# Altium schematic sheet 5_Regulator.SchDoc
size A4; SheetNumber: 6; SheetTotal: 6
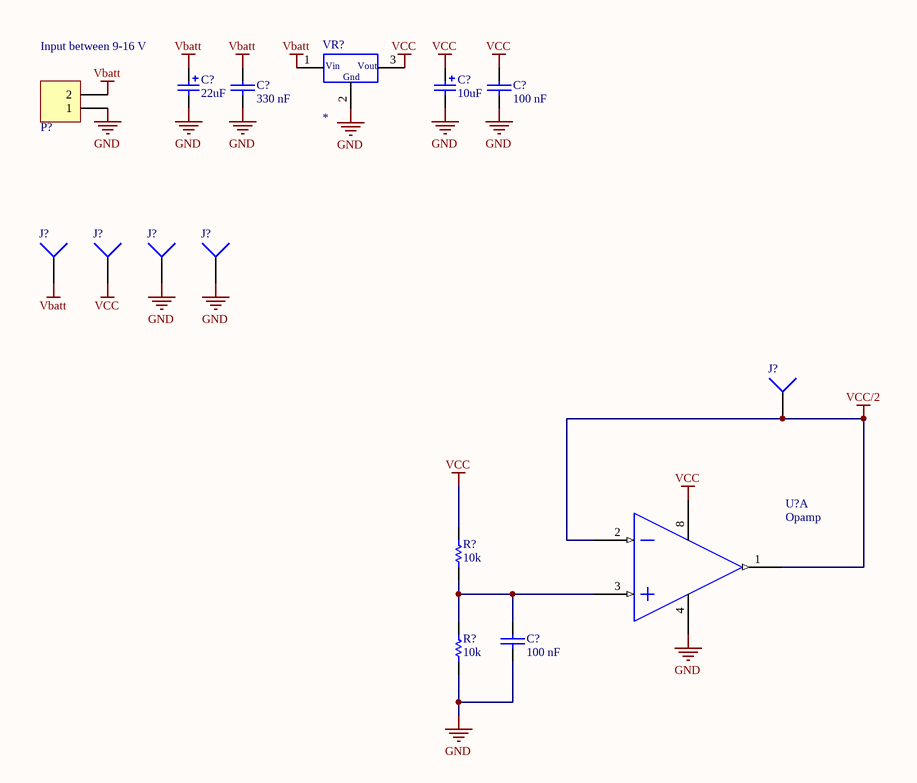
[diagram p0: 5_Regulator.SchDoc]

## Parts
(Parts that share a designator on the sheet are numbered #1, #2 ... from top to bottom, then left to right.)
C?#1  22uF  [ece-CAPAD2TH0.3]
C?#2  330 nF  [ece-RAD0.2]
C?#3  10uF  [ece-CAPAD2TH0.3]
C?#4  100 nF  [ece-RAD0.2]
C?#5  100 nF  [ece-RAD0.2]
J?#1  Vbatt  [ece-HDR1]  (value not drawn)
J?#2  Vcc  [ece-HDR1]  (value not drawn)
J?#3  GND  [ece-HDR1]  (value not drawn)
J?#4  GND  [ece-HDR1]  (value not drawn)
J?#5  Vcc/2  [ece-HDR1]  (value not drawn)
P?  Header 2  [ece-TER2-10MM]  (value not drawn)
R?#1  10k  [ece-AXIAL0.4]
R?#2  10k  [ece-AXIAL0.4]
U?  Opamp  [ECE-DIP8]  (part A of 2)
VR?  *  [ece-TO220]

## Nets
GND: C?#1.2 C?#2.2 C?#3.2 C?#4.2 C?#5.2 J?#3.1 J?#4.1 P?.1 R?#2.1 U?.4(GND) VR?.2(Gnd)
Vbatt: C?#1.1 C?#2.1 J?#1.1 P?.2 VR?.1(Vin)
VCC: C?#3.1 C?#4.1 J?#2.1 R?#1.2 U?.8(V(+)) VR?.3(Vout)
VCC/2: J?#5.1 U?.1(OUT1) U?.2(IN1(-))
NetC?#5_1: C?#5.1 R?#1.1 R?#2.2 U?.3(IN1(+))

## Notes on the sheet
- Input between 9-16 V

## Library data of the parts
C?#1 C?#3 = CAP 22uF TH: Polarized Capacitor (Radial); Manufacturer: Generic Components; Class I: Passive; Published: 8-Jun-2000; Revision: July-2002: Re-released for DXP Platform.; Publisher: Altium Limited; Class II: Capacitor
  C?#1: Value: 22uF
  C?#3: Value: 10uF
C?#2 C?#4 C?#5 = CAP: Capacitor Non Polarised Through Hole
  C?#2: Value: 330 nF
  C?#4 C?#5: Value: 100 nF
J?#1-J?#5 = Test pin: Socket; LatestRevisionDate: 17-Jul-2002; LatestRevisionNote: Re-released for DXP Platform.; Publisher: Altium Limited
P? = TERMINAL 2: Large 2 way screw connector
R?#1 R?#2 = Res1: Resistor; Published: 8-Jun-2000; LatestRevisionDate: 17-Jul-2002; LatestRevisionNote: Re-released for DXP Platform.; PackageReference: AXIAL-0.3; Publisher: Altium Limited; Value: 10k
U? = TLC082
VR? = VoltRegBig: Voltage Regulator; Value: *